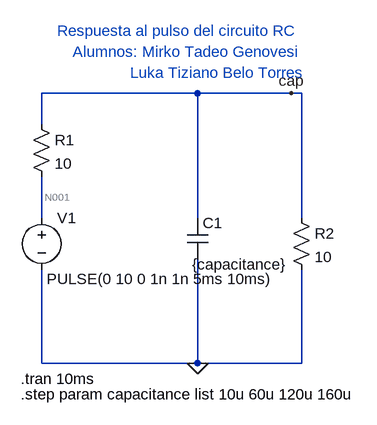
[diagram p0: schematic Carga y Descarga capacitor.asc]
Carga y Descarga capacitor.asc, the LTspice schematic file:
Version 4
SHEET 1 1200 680
WIRE 368 -80 128 -80
WIRE 512 -80 368 -80
WIRE 528 -80 512 -80
WIRE 128 -32 128 -80
WIRE 128 112 128 48
WIRE 368 112 368 -80
WIRE 528 112 528 -80
WIRE 128 336 128 192
WIRE 368 336 368 176
WIRE 368 336 128 336
WIRE 528 336 528 192
WIRE 528 336 368 336
FLAG 368 336 0
FLAG 512 -80 cap
SYMBOL voltage 128 96 R0
WINDOW 3 8 110 Left 2
WINDOW 123 0 0 Left 0
WINDOW 39 0 0 Left 0
SYMATTR Value PULSE(0 10 0 1n 1n 5ms 10ms)
SYMATTR InstName V1
SYMBOL cap 352 112 R0
WINDOW 3 8 72 Left 2
SYMATTR Value {capacitance}
SYMATTR InstName C1
SYMBOL res 112 -48 R0
SYMATTR InstName R1
SYMATTR Value 10
SYMBOL res 512 96 R0
SYMATTR InstName R2
SYMATTR Value 10
TEXT 96 384 Left 2 !.step param capacitance list 10u 60u 120u 160u
TEXT 96 360 Left 2 !.tran 10ms
TEXT 152 -176 Left 2 ;Respuesta al pulso del circuito RC
TEXT 176 -144 Left 2 ;Alumnos: Mirko Tadeo Genovesi
TEXT 264 -112 Left 2 ;Luka Tiziano Belo Torres

The netlist it stands for:
* Carga y Descarga capacitor.asc
V1 N001 0 PULSE(0 10 0 1n 1n 5ms 10ms)
C1 cap 0 {capacitance}
R1 cap N001 10
R2 cap 0 10
.step param capacitance list 10u 60u 120u 160u
.tran 10ms
* Respuesta al pulso del circuito RC
* Alumnos: Mirko Tadeo Genovesi
* Luka Tiziano Belo Torres
.backanno
.end

* Results of the author's LTspice run, read from the files saved beside the schematic
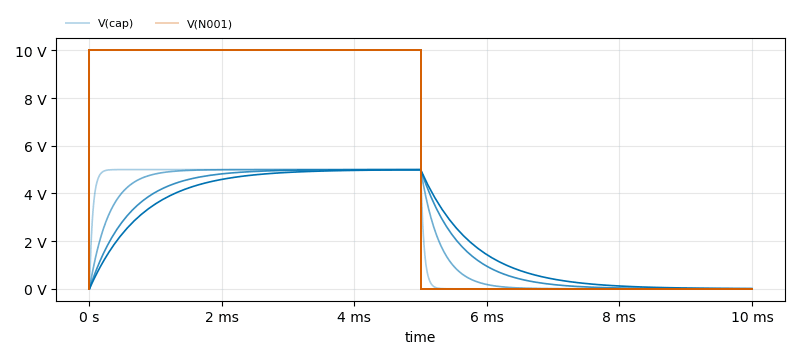
[diagram p1: Transient Analysis of Carga y Descarga capacitor.asc, plotted from the saved traces]
* Transient Analysis, 4 runs:
*   V(cap) [capacitance=1e-05]: min 0 V, max 5 V, average 2.5 V, rms 3.518 V, last 0 V
*   V(cap) [capacitance=6e-05]: min 0 V, max 5 V, average 2.5 V, rms 3.428 V, last 0 V
*   V(cap) [capacitance=0.00012]: min 0 V, max 4.999 V, average 2.5 V, rms 3.317 V, last 1.201 mV
*   V(cap) [capacitance=0.00016]: min 0 V, max 4.99 V, average 2.499 V, rms 3.242 V, last 9.633 mV
*   V(N001) [capacitance=1e-05]: min 0 V, max 10 V, average 5 V, rms 7.071 V, last 0 V
*   V(N001) [capacitance=6e-05]: min 0 V, max 10 V, average 5 V, rms 7.071 V, last 0 V
*   V(N001) [capacitance=0.00012]: min 0 V, max 10 V, average 5 V, rms 7.071 V, last 0 V
*   V(N001) [capacitance=0.00016]: min 0 V, max 10 V, average 5 V, rms 7.071 V, last 0 V